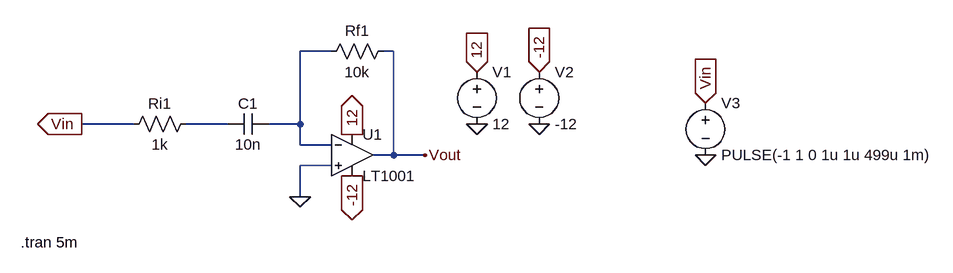
[diagram p0: schematic lab8.3.3.asc]
lab8.3.3.asc, the LTspice schematic file:
Version 4
SHEET 1 1000 680
WIRE 16 32 -32 32
WIRE 112 32 96 32
WIRE -288 144 -368 144
WIRE -144 144 -208 144
WIRE -32 144 -32 32
WIRE -32 144 -80 144
WIRE -32 176 -32 144
WIRE 16 176 -32 176
WIRE 112 192 112 32
WIRE 112 192 80 192
WIRE 160 192 112 192
WIRE 16 208 -32 208
WIRE -32 256 -32 208
FLAG 240 144 0
FLAG 336 144 0
FLAG 240 64 12
IOPIN 240 64 In
FLAG 48 160 12
IOPIN 48 160 Out
FLAG 336 64 -12
IOPIN 336 64 In
FLAG 48 224 -12
IOPIN 48 224 Out
FLAG 592 112 Vin
IOPIN 592 112 In
FLAG -368 144 Vin
IOPIN -368 144 Out
FLAG 160 192 Vout
FLAG -32 256 0
FLAG 592 192 0
SYMBOL voltage 240 48 R0
SYMATTR InstName V1
SYMATTR Value 12
SYMBOL voltage 336 48 R0
SYMATTR InstName V2
SYMATTR Value -12
SYMBOL res 112 16 R90
WINDOW 0 0 56 VBottom 2
WINDOW 3 32 56 VTop 2
SYMATTR InstName Rf1
SYMATTR Value 10k
SYMBOL cap -80 128 R90
WINDOW 0 0 32 VBottom 2
WINDOW 3 32 32 VTop 2
SYMATTR InstName C1
SYMATTR Value 10n
SYMBOL Opamps\\LT1001 48 128 R0
SYMATTR InstName U1
SYMBOL res -192 128 R90
WINDOW 0 0 56 VBottom 2
WINDOW 3 32 56 VTop 2
SYMATTR InstName Ri1
SYMATTR Value 1k
SYMBOL voltage 592 96 R0
WINDOW 123 0 0 Left 0
WINDOW 39 0 0 Left 0
SYMATTR InstName V3
SYMATTR Value PULSE(-1 1 0 1u 1u 499u 1m)
TEXT -462 326 Left 2 !.tran 5m

The netlist it stands for:
* lab8.3.3.asc
V1 12 0 12
V2 -12 0 -12
Rf1 Vout N001 10k
C1 N001 N002 10n
XU1 0 N001 12 -12 Vout LT1001  ; pins In+ In- V+ V- OUT
Ri1 N002 Vin 1k
V3 Vin 0 PULSE(-1 1 0 1u 1u 499u 1m)
.tran 5m
.lib LTC.lib
.backanno
.end